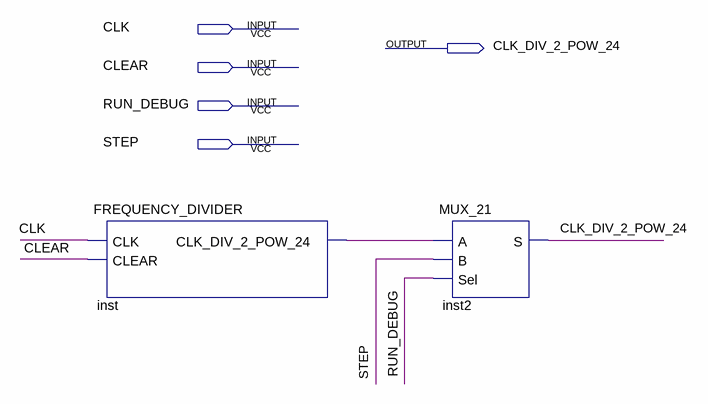
[diagram p0: schematic sheet]
// Quartus schematic FREQUENCY_CONTROLLER.bdf as structural Verilog: 2 symbols, 5 pins
module FREQUENCY_CONTROLLER (
  input  CLK,
  input  CLEAR,
  input  RUN_DEBUG,
  input  STEP,
  output CLK_DIV_2_POW_24
);

  wire inst_clk_div_2_pow_24;

  FREQUENCY_DIVIDER inst (.CLK(CLK), .CLEAR(CLEAR), .CLK_DIV_2_POW_24(inst_clk_div_2_pow_24));
  MUX_21 inst2 (.A(inst_clk_div_2_pow_24), .B(STEP), .Sel(RUN_DEBUG), .S(CLK_DIV_2_POW_24));
endmodule
